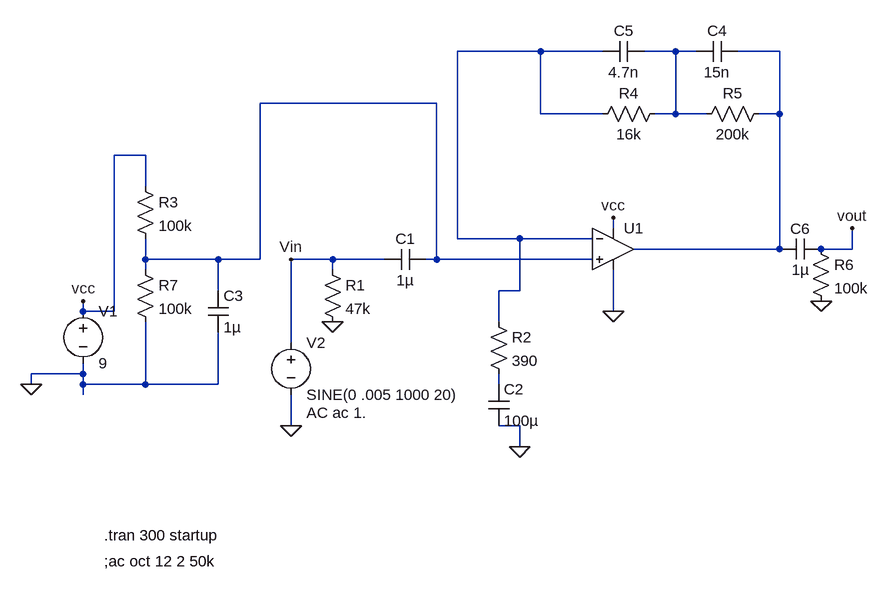
[diagram p0: schematic an-346-noninvert.asc]
an-346-noninvert.asc, the LTspice schematic file:
Version 4
SHEET 1 1152 680
WIRE 624 -256 496 -256
WIRE 720 -256 624 -256
WIRE 832 -256 784 -256
WIRE 864 -256 832 -256
WIRE 992 -256 928 -256
WIRE 464 -176 192 -176
WIRE 624 -160 624 -256
WIRE 720 -160 624 -160
WIRE 832 -160 832 -256
WIRE 832 -160 800 -160
WIRE 880 -160 832 -160
WIRE 992 -160 992 -256
WIRE 992 -160 960 -160
WIRE 16 -96 -32 -96
WIRE 16 -48 16 -96
WIRE 736 16 736 0
WIRE 496 32 496 -256
WIRE 592 32 496 32
WIRE 704 32 592 32
WIRE 992 48 992 -160
WIRE 992 48 768 48
WIRE 1104 48 1104 16
WIRE 1104 48 1056 48
WIRE 16 64 16 32
WIRE 128 64 16 64
WIRE 192 64 192 -176
WIRE 192 64 128 64
WIRE 304 64 240 64
WIRE 384 64 304 64
WIRE 464 64 464 -176
WIRE 464 64 448 64
WIRE 704 64 464 64
WIRE 16 80 16 64
WIRE 304 80 304 64
WIRE 128 112 128 64
WIRE 592 112 592 32
WIRE 592 112 560 112
WIRE -80 144 -80 128
WIRE -32 144 -32 -96
WIRE -32 144 -80 144
WIRE 736 144 736 80
WIRE 752 144 736 144
WIRE 560 160 560 112
WIRE 240 192 240 64
WIRE -80 240 -80 224
WIRE -80 240 -160 240
WIRE -160 256 -160 240
WIRE -80 256 -80 240
WIRE 16 256 16 160
WIRE 16 256 -80 256
WIRE 128 256 128 176
WIRE 128 256 16 256
WIRE 560 256 560 240
WIRE -80 272 -80 256
WIRE 240 320 240 272
WIRE 592 320 560 320
WIRE 592 352 592 320
FLAG -160 256 0
FLAG 240 320 0
FLAG 736 0 vcc
FLAG -80 128 vcc
FLAG 304 160 0
FLAG 592 352 0
FLAG 1056 128 0
FLAG 1104 16 vout
FLAG 240 64 Vin
FLAG 736 144 0
SYMBOL voltage -80 128 R0
WINDOW 123 0 0 Left 2
WINDOW 39 0 0 Left 2
SYMATTR InstName V1
SYMATTR Value 9
SYMBOL voltage 240 176 R0
WINDOW 123 24 124 Left 2
WINDOW 39 24 152 Left 2
SYMATTR Value2 AC ac 1.
SYMATTR InstName V2
SYMATTR Value SINE(0 .005 1000 20)
SYMBOL Opamps\\UniversalOpamp2 736 48 R0
SYMATTR InstName U1
SYMBOL res 288 64 R0
SYMATTR InstName R1
SYMATTR Value 47k
SYMBOL res 544 144 R0
SYMATTR InstName R2
SYMATTR Value 390
SYMBOL res 816 -176 R90
WINDOW 0 0 56 VBottom 2
WINDOW 3 32 56 VTop 2
SYMATTR InstName R4
SYMATTR Value 16k
SYMBOL res 976 -176 R90
WINDOW 0 0 56 VBottom 2
WINDOW 3 32 56 VTop 2
SYMATTR InstName R5
SYMATTR Value 200k
SYMBOL cap 544 256 R0
SYMATTR InstName C2
SYMATTR Value 100µ
SYMBOL cap 928 -272 R90
WINDOW 0 0 32 VBottom 2
WINDOW 3 32 32 VTop 2
SYMATTR InstName C4
SYMATTR Value 15n
SYMBOL cap 784 -272 R90
WINDOW 0 0 32 VBottom 2
WINDOW 3 32 32 VTop 2
SYMATTR InstName C5
SYMATTR Value 4.7n
SYMBOL cap 1056 32 R90
WINDOW 0 0 32 VBottom 2
WINDOW 3 32 32 VTop 2
SYMATTR InstName C6
SYMATTR Value 1µ
SYMBOL res 1040 32 R0
SYMATTR InstName R6
SYMATTR Value 100k
SYMBOL cap 448 48 R90
WINDOW 0 0 32 VBottom 2
WINDOW 3 32 32 VTop 2
SYMATTR InstName C1
SYMATTR Value 1µ
SYMBOL res 0 -64 R0
SYMATTR InstName R3
SYMATTR Value 100k
SYMBOL res 0 64 R0
SYMATTR InstName R7
SYMATTR Value 100k
SYMBOL cap 112 112 R0
SYMATTR InstName C3
SYMATTR Value 1µ
TEXT -48 488 Left 2 !.tran 300 startup
TEXT -48 528 Left 2 !;ac oct 12 2 50k

The netlist it stands for:
* an-346-noninvert.asc
V1 vcc 0 9
V2 Vin 0 SINE(0 .005 1000 20) AC ac 1.
XU1 N004 N001 vcc 0 N003 level.2 Avol=1Meg GBW=10Meg Slew=10Meg ilimit=25m rail=0 Vos=0 phimargin=45 en=0 enk=0 in=0 ink=0 Rin=500Meg  ; pins IN+ IN- V+ V- OUT
R1 Vin 0 47k
R2 N001 N005 390
R4 N002 N001 16k
R5 N003 N002 200k
C2 N005 0 100µ
C4 N003 N002 15n
C5 N002 N001 4.7n
C6 vout N003 1µ
R6 vout 0 100k
C1 N004 Vin 1µ
R3 vcc N004 100k
R7 N004 0 100k
C3 N004 0 1µ
.tran 300 startup
;ac oct 12 2 50k
.lib UniversalOpamps2.sub
.backanno
.end